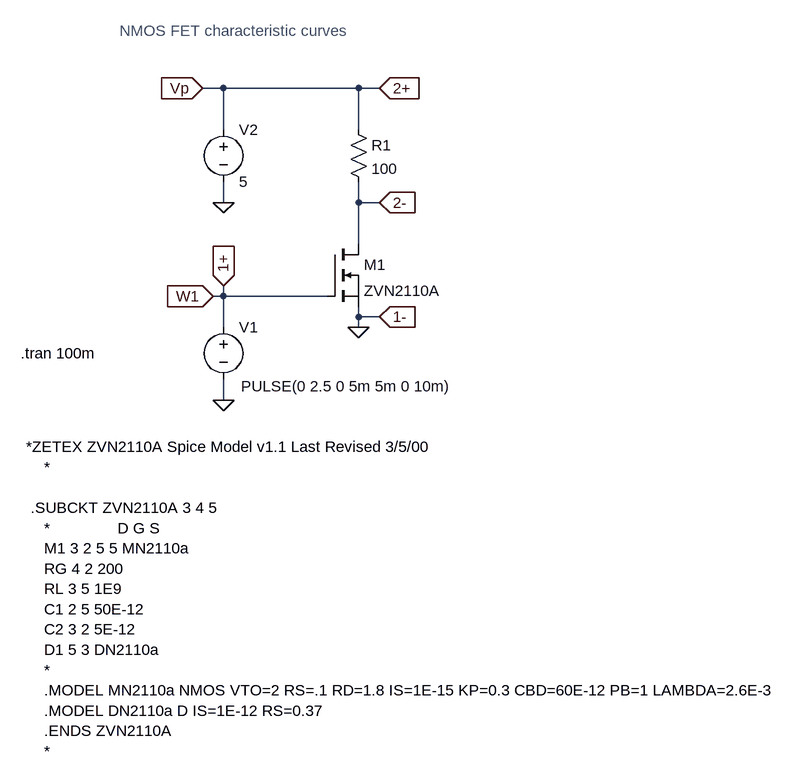
[diagram p0: schematic meas_vgs.asc]
meas_vgs.asc, the LTspice schematic file:
Version 4
SHEET 1 1504 748
WIRE 560 -192 528 -192
WIRE 768 -192 560 -192
WIRE 800 -192 768 -192
WIRE 560 -128 560 -192
WIRE 768 -128 768 -192
WIRE 560 -16 560 -48
WIRE 768 -16 768 -48
WIRE 800 -16 768 -16
WIRE 768 48 768 -16
WIRE 560 128 560 112
WIRE 560 128 544 128
WIRE 720 128 560 128
WIRE 768 160 768 144
WIRE 800 160 768 160
WIRE 560 176 560 128
WIRE 768 176 768 160
WIRE 560 288 560 256
FLAG 768 176 0
FLAG 560 288 0
FLAG 560 -16 0
FLAG 544 128 W1
IOPIN 544 128 In
FLAG 560 112 1+
IOPIN 560 112 In
FLAG 800 -192 2+
IOPIN 800 -192 In
FLAG 528 -192 Vp
IOPIN 528 -192 In
FLAG 800 -16 2-
IOPIN 800 -16 In
FLAG 800 160 1-
IOPIN 800 160 In
SYMBOL nmos 720 48 R0
SYMATTR InstName M1
SYMATTR Value ZVN2110A
SYMATTR Prefix X
SYMBOL res 752 -144 R0
SYMATTR InstName R1
SYMATTR Value 100
SYMBOL voltage 560 160 R0
WINDOW 123 0 0 Left 0
WINDOW 39 0 0 Left 0
WINDOW 3 27 107 Left 2
SYMATTR Value PULSE(0 2.5 0 5m 5m 0 10m)
SYMATTR InstName V1
SYMBOL voltage 560 -144 R0
WINDOW 123 0 0 Left 0
WINDOW 39 0 0 Left 0
SYMATTR InstName V2
SYMATTR Value 5
TEXT 248 216 Left 2 !.tran 100m
TEXT 400 -280 Left 2 ;NMOS FET characteristic curves
TEXT 256 360 Left 2 !*ZETEX ZVN2110A Spice Model v1.1 Last Revised 3/5/00\n    *\n   \n .SUBCKT ZVN2110A 3 4 5\n    *               D G S\n    M1 3 2 5 5 MN2110a\n    RG 4 2 200\n    RL 3 5 1E9\n    C1 2 5 50E-12\n    C2 3 2 5E-12\n    D1 5 3 DN2110a\n    *\n    .MODEL MN2110a NMOS VTO=2 RS=.1 RD=1.8 IS=1E-15 KP=0.3 CBD=60E-12 PB=1 LAMBDA=2.6E-3\n    .MODEL DN2110a D IS=1E-12 RS=0.37\n    .ENDS ZVN2110A\n    *

The netlist it stands for:
* meas_vgs.asc
XM1 2- 1+ 0 ZVN2110A  ; pins D G S
R1 Vp 2- 100
V1 1+ 0 PULSE(0 2.5 0 5m 5m 0 10m)
V2 Vp 0 5
.tran 100m
* NMOS FET characteristic curves
*ZETEX ZVN2110A Spice Model v1.1 Last Revised 3/5/00
    *
 .SUBCKT ZVN2110A 3 4 5
    *               D G S
    M1 3 2 5 5 MN2110a
    RG 4 2 200
    RL 3 5 1E9
    C1 2 5 50E-12
    C2 3 2 5E-12
    D1 5 3 DN2110a
    *
    .MODEL MN2110a NMOS VTO=2 RS=.1 RD=1.8 IS=1E-15 KP=0.3 CBD=60E-12 PB=1 LAMBDA=2.6E-3
    .MODEL DN2110a D IS=1E-12 RS=0.37
    .ENDS ZVN2110A
    *
.backanno
.end